# EAGLE design weichen-a-3 (EAGLE 9.6.2)
AUTHOR: Balazs Racz; DRAWING_TITLE: MEB Schalterwerk Projekt; LICENSE: Licensed by the Solderpad Hardware License V2.0; REVIEWER: n/a; REVISION: A; YEAR: 2023
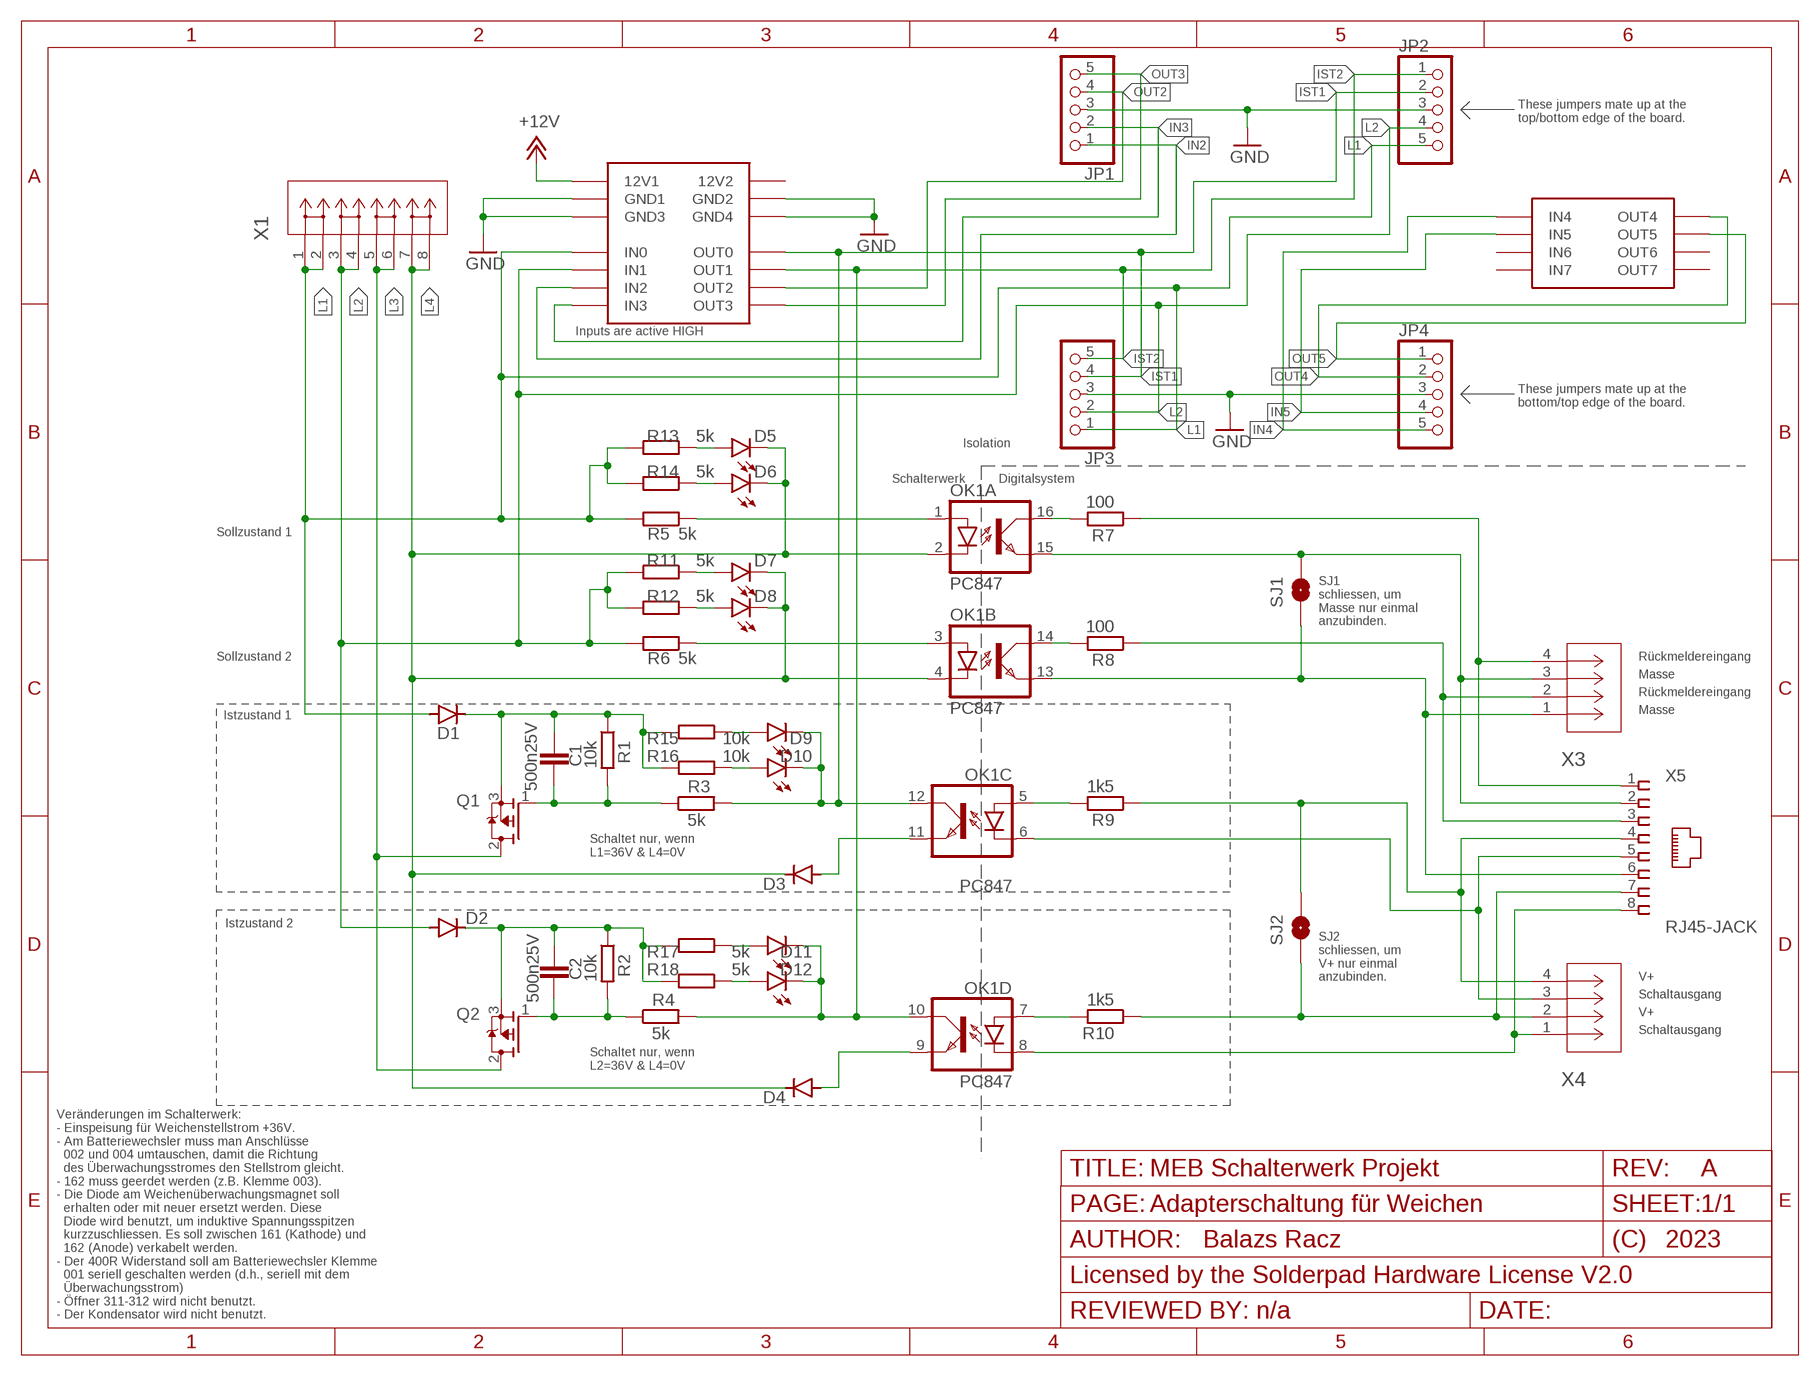
[diagram p0: schematic, sheet 1]
FRAME1 (FRAME_A_L): PAGE: Input ports
FRAME2 (FRAME_A_L): PAGE: Adapterschaltung für Weichen

## Parts
C1  500n25V  C-EUC0805  [C0805]
C2  500n25V  C-EUC0805  [C0805]
D1  DIODE-DO214AC  [DO214AC]
D2  DIODE-DO214AC  [DO214AC]
D3  DIODE-MINIMELF  [MINIMELF]
D4  DIODE-MINIMELF  [MINIMELF]
D5  LEDCHIPLED_0603  [CHIPLED_0603]
D6  LEDHEADER  [LEDHEADER]
D7  LEDCHIPLED_0603  [CHIPLED_0603]
D8  LEDHEADER  [LEDHEADER]
D9  LEDCHIPLED_0603  [CHIPLED_0603]
D10  LEDHEADER  [LEDHEADER]
D11  LEDCHIPLED_0603  [CHIPLED_0603]
D12  LEDHEADER  [LEDHEADER]
JP1  PINHD-1X55X2MM  [1_05X2MM]
JP2  PINHD-1X55X2MM  [1_05X2MM]
JP3  PINHD-1X55X2MM  [1_05X2MM]
JP4  PINHD-1X55X2MM  [1_05X2MM]
OK1  PC847  [DIL16]
Q1  P-MOSFET  [DPAK-2]
Q2  P-MOSFET  [DPAK-2]
R1  10k  R-EU_R0805  [R0805]
R2  10k  R-EU_R0805  [R0805]
R3  5k  R-EU_R0805  [R0805]
R4  5k  R-EU_R0805  [R0805]
R5  5k  R-EU_R0805  [R0805]
R6  5k  R-EU_R0805  [R0805]
R7  100  R-EU_R0805  [R0805]
R8  100  R-EU_R0805  [R0805]
R9  1k5  R-EU_R0805  [R0805]
R10  1k5  R-EU_R0805  [R0805]
R11  5k  R-EU_R0805  [R0805]
R12  5k  R-EU_R0805  [R0805]
R13  5k  R-EU_R0805  [R0805]
R14  5k  R-EU_R0805  [R0805]
R15  10k  R-EU_R0805  [R0805]
R16  10k  R-EU_R0805  [R0805]
R17  5k  R-EU_R0805  [R0805]
R18  5k  R-EU_R0805  [R0805]
SJ1  SJRND2  [SJ_RND2]
SJ2  SJRND2  [SJ_RND2]
X1  PHNX_4P_508CONN_1017493  [PHNX_4P_508]
X2  IO-HAT  [IOBOARD]
X3  PHNX_4P_350CONN_1984989_PXC  [PHNX_4P_350]
X4  PHNX_4P_350CONN_1984989_PXC  [PHNX_4P_350]
X5  RJ45-JACK  RJ45-JACKRJ45-PULSE-E5J00  [RJ45-PULSE-E5J88]

## Nets
+12V: X2.P$1(12V1)
GND: JP1.3 JP2.3 JP3.3 JP4.3 X2.P$2(GND1) X2.P$11(GND3) X2.P$12(GND4) X2.P$21(GND2)
IN2: JP1.1 X2.P$5(IN2)
IN3: JP1.2 X2.P$6(IN3)
IN4: JP4.5 X2.P$7(IN4)
IN5: JP4.4 X2.P$8(IN5)
IST1: D9.C D10.C JP2.2 JP3.4 OK1.12(C:COL) R3.2 X2.P$20(OUT0)
IST2: D11.C D12.C JP2.1 JP3.5 OK1.10(D:COL) R4.2 X2.P$19(OUT1)
L1: D1.A JP2.5 JP3.1 R5.2 R13.2 R14.2 X1.1 X1.2 X2.P$3(IN0)
L2: D2.A JP2.4 JP3.2 R6.2 R11.2 R12.2 X1.3 X1.4 X2.P$4(IN1)
L3: Q1.2(D) Q2.2(D) X1.5 X1.6
L4: D3.C D4.C D5.C D6.C D7.C D8.C OK1.2(A:C) OK1.4(B:C) X1.7 X1.8
N$1: C2.1 D2.C Q2.3(S) R2.1 R17.2 R18.2
N$2: OK1.1(A:A) R5.1
N$3: D7.A R11.1
N$4: D5.A R13.1
N$5: OK1.5(C:A) R9.2
N$6: D6.A R14.1
N$7: OK1.3(B:A) R6.1
N$8: OK1.7(D:A) R10.2
N$10: D8.A R12.1
N$11: D9.A R15.1
N$12: C2.2 Q2.1(G) R2.2 R4.1
N$13: C1.1 D1.C Q1.3(S) R1.1 R15.2 R16.2
N$14: D10.A R16.1
N$17: D3.A OK1.11(C:EMIT)
N$18: D11.A R17.1
N$19: OK1.16(A:COL) R7.2
N$20: D12.A R18.1
N$21: OK1.14(B:COL) R8.2
N$22: D4.A OK1.9(D:EMIT)
N$23: C1.2 Q1.1(G) R1.2 R3.1
NX41: R7.1 X3.4 X5.1
NX42: OK1.15(A:EMIT) SJ1.P$2 X3.3 X5.2
NX43: R8.1 X3.2 X5.3
NX44: R9.1 SJ2.P$2 X4.4 X5.4
NX45: OK1.6(C:C) X4.3 X5.5
NX46: OK1.13(B:EMIT) SJ1.P$1 X3.1 X5.6
NX47: R10.1 SJ2.P$1 X4.2 X5.7
NX48: OK1.8(D:C) X4.1 X5.8
OUT2: JP1.4 X2.P$18(OUT2)
OUT3: JP1.5 X2.P$17(OUT3)
OUT4: JP4.2 X2.P$16(OUT4)
OUT5: JP4.1 X2.P$15(OUT5)
Unconnected: X2.P$9(IN6) X2.P$10(IN7) X2.P$13(OUT7) X2.P$14(OUT6)

## Notes on the sheet
- These jumpers mate up at the 
  top/bottom edge of the board.
- Inputs are active HIGH
- These jumpers mate up at the 
  bottom/top edge of the board.
- Isolation
- Schalterwerk | Digitalsystem
- Sollzustand 1
- SJ1
  schliessen, um
  Masse nur einmal
  anzubinden.
- Sollzustand 2 | Rückmeldereingang
- Masse
- Rückmeldereingang
- Masse
- Istzustand 1
- Schaltet nur, wenn
  L1=36V & L4=0V
- Istzustand 2
- SJ2
  schliessen, um
  V+ nur einmal
  anzubinden.
- V+
- Schaltausgang
- V+
- Schaltausgang
- Schaltet nur, wenn
  L2=36V & L4=0V
- Veränderungen im Schalterwerk:
  - Einspeisung für Weichenstellstrom +36V.
  - Am Batteriewechsler muss man Anschlüsse
    002 und 004 umtauschen, damit die Richtung
    des Überwachungsstromes den Stellstrom gleicht.
  - 162 muss geerdet werden (z.B. Klemme 003).
  - Die Diode am Weichenüberwachungsmagnet soll 
    erhalten oder mit neuer ersetzt werden. Diese
    Diode wird benutzt, um induktive Spannungsspitzen
    kurzzuschliessen. Es soll zwischen 161 (Kathode) und
    162 (Anode) verkabelt werden.
  - Der 400R Widerstand soll am Batteriewechsler Klemme
    001 seriell geschalten werden (d.h., seriell mit dem 
    Überwachungsstrom)
  - Öffner 311-312 wird nicht benutzt.
  - Der Kondensator wird nicht benutzt.

## Power pins joined to a net without a drawn wire
12V2: X2.P$22(12V2)

## Library data of the parts
C1 C2 = rcl:C-EU: CAPACITOR, European symbol; SPICEPREFIX: C
D1-D4 = diode:DIODE-: DIODE
D5 D7 D9 D11 = led:LED: LED OSRAM: - CHIPLED LG R971, LG N971, LY N971, LG Q971, LY Q971, LO R971, LY R971 LH N974, LH R974 LS Q976, LO Q976, LY Q976 LO Q996 - Hyper CHIPLED LW Q18S LB Q993, LB Q99A, LB R99A - SideLED LS A670, LO A670, LY A670, LG A670, LP A670 LB A673, LV A673, LT A673, LW A673 LH A674 LY A675 LS A676, LA A676, LO A676, LY A676, LW A676 LS A679, LY A679, LG A679 - Hyper Micro SIDELED® LS Y876, LA Y876, LO Y876, LY Y876 LT Y87S - SmartLED LW L88C, LW L88S LB L89C, LB L89S, LG L890 LS L89K, LO L89K, LY L89K LS L896, LA L896, LO L896, LY L896 - TOPLED LS T670, LO T670, LY T670, LG T670, LP T670 LSG T670, LSP T670, LSY T670, LOP T670, LYG T670 LG T671, LOG T671, LSG T671 LB T673, LV T673, LT T673, LW T673 LH T674 LS T676, LA T676, LO T676, LY T676, LB T676, LH T676, LSB T676, LW T676 LB T67C, LV T67C, LT T67C, LS T67K, LO T67K, LY T67K, LW E67C LS E67B, LA E67B, LO E67B, LY E67B, LB E67C, LV E67C, LT E67C LW T67C LS T679, LY T679, LG T679 LS T770, LO T770, LY T770, LG T770, LP T770 LB T773, LV T773, LT T773, LW T773 LH T774 LS E675, LA E675, LY E675, LS T675 LS T776, LA T776, LO T776, LY T776, LB T776 LHGB T686 LT T68C, LB T68C - Hyper Mini TOPLED® LB M676 - Mini TOPLED Santana® LG M470 LS M47K, LO M47K, LY M47K Source: http://www.osram.convergy.de LUXEON: - LUMILED® LXK2-PW12-R00, LXK2-PW12-S00, LXK2-PW14-U00, LXK2-PW14-V00 LXK2-PM12-R00, LXK2-PM12-S00, LXK2-PM14-U00 LXK2-PE12-Q00, LXK2-PE12-R00, LXK2-PE12-S00, LXK2-PE14-T00, LXK2-PE14-U00 LXK2-PB12-K00, LXK2-PB12-L00, LXK2-PB12-M00, LXK2-PB14-N00, LXK2-PB14-P00, LXK2-PB14-Q00 LXK2-PR12-L00, LXK2-PR12-M00, LXK2-PR14-Q00, LXK2-PR14-R00 LXK2-PD12-Q00, LXK2-PD12-R00, LXK2-PD12-S00 LXK2-PH12-R00, LXK2-PH12-S00 LXK2-PL12-P00, LXK2-PL12-Q00, LXK2-PL12-R00 Source: www.luxeon.com KINGBRIGHT: KA-3528ASYC Source: www.kingbright.com
D6 D8 D10 D12 = eagleparts:LEDHEADER
JP1-JP4 = pinhead:PINHD-1X5: PIN HEADER
OK1 = optocoupler:PC847: SHARP OPTO COUPLER; OC_FARNELL: 9707735; OC_NEWARK: unknown
Q1 Q2 = eagleparts:P-MOSFET: RoHS Compliant | Low RDS(on) | Industry-leading quality | Dynamic dv/dt Rating | Fast Switching | Fully Avalanche Rated | 175C Operating Temperature | P-Channel MOSFET; MANUFACTURER: Infineon; MAXIMUM_PACKAGE_HEIGHT: 2.39 mm; PARTREV: 12/14/04; STANDARD: IPC-7351B
R1-R18 = rcl:R-EU_: RESISTOR, European symbol; SPICEPREFIX: R
SJ1 SJ2 = eagleparts:SJ: SMD solder JUMPER
X1 = eagleparts:PHNX_4P_508: https://www.digikey.com/en/products/detail/phoenix-contact/1017505/9346606 DigiKey 277-17516-ND; COPYRIGHT: Copyright (C) 2023 Ultra Librarian. All rights reserved.; MANUFACTURER_PART_NUMBER: 1017505; MFR_NAME: Phoenix Contact
X2 = eagleparts:IO-HAT
X3 X4 = eagleparts:PHNX_4P_350: https://www.digikey.com/en/products/detail/phoenix-contact/1984989/2513979 DigiKey 277-6404-ND; COPYRIGHT: Copyright (C) 2023 Ultra Librarian. All rights reserved.; MANUFACTURER_PART_NUMBER: 1984989; MFR_NAME: Phoenix Contact
X5 = trainlib:RJ45-JACK: Mod. Jack, Right Angle, 8 posiotion, 8 contatcs RJ45 Source: GLX-S-88M.pdf

## Board
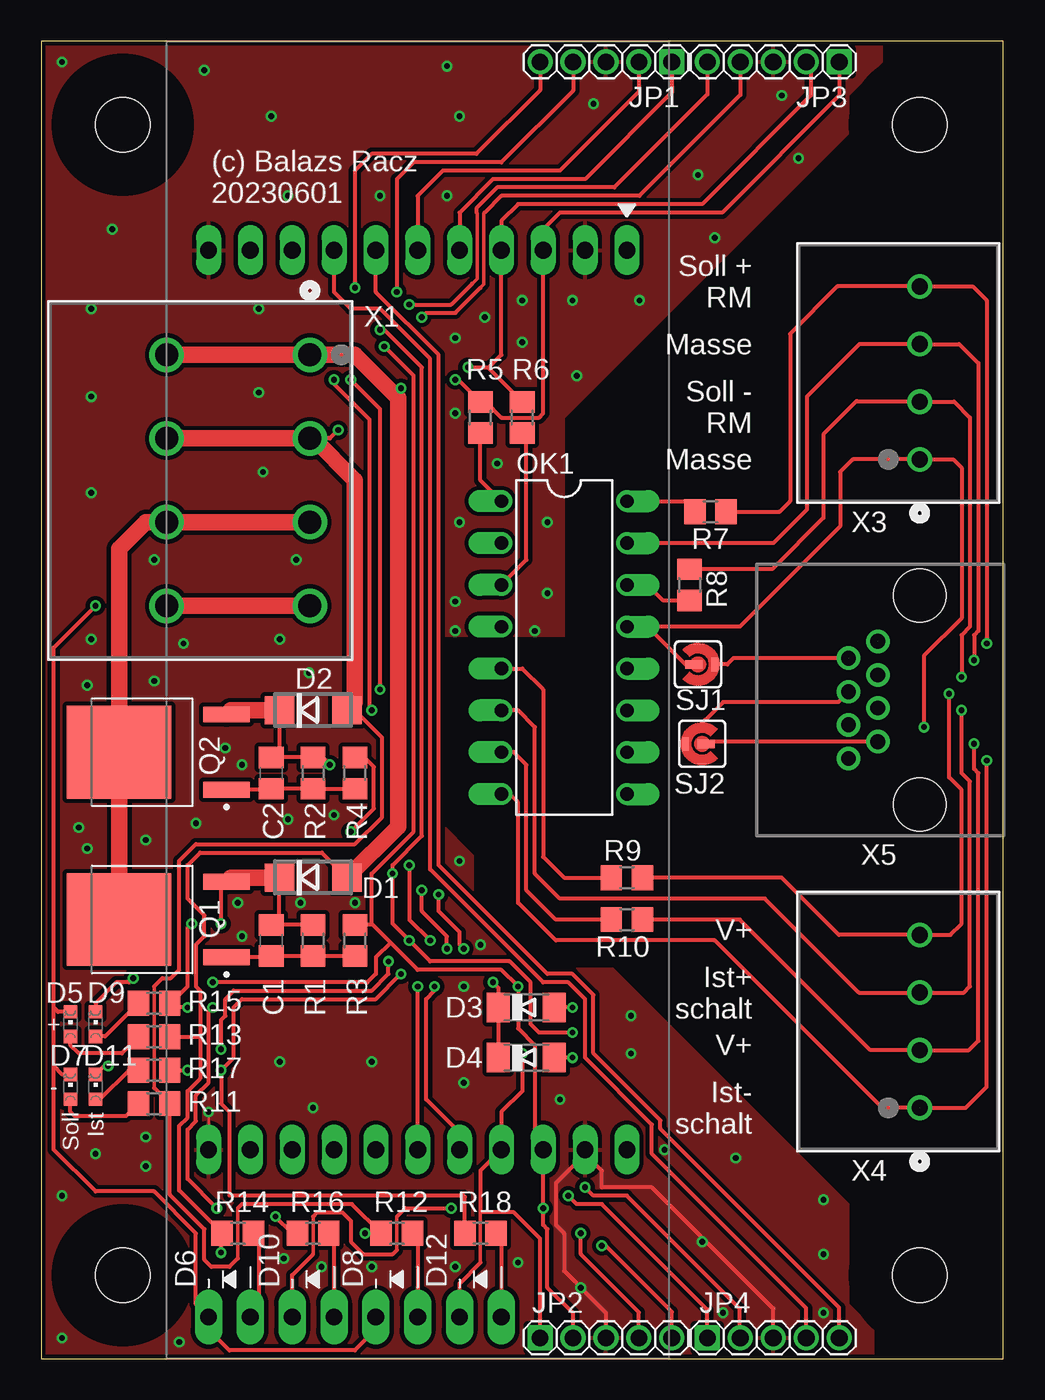
[diagram p1: board, top side]
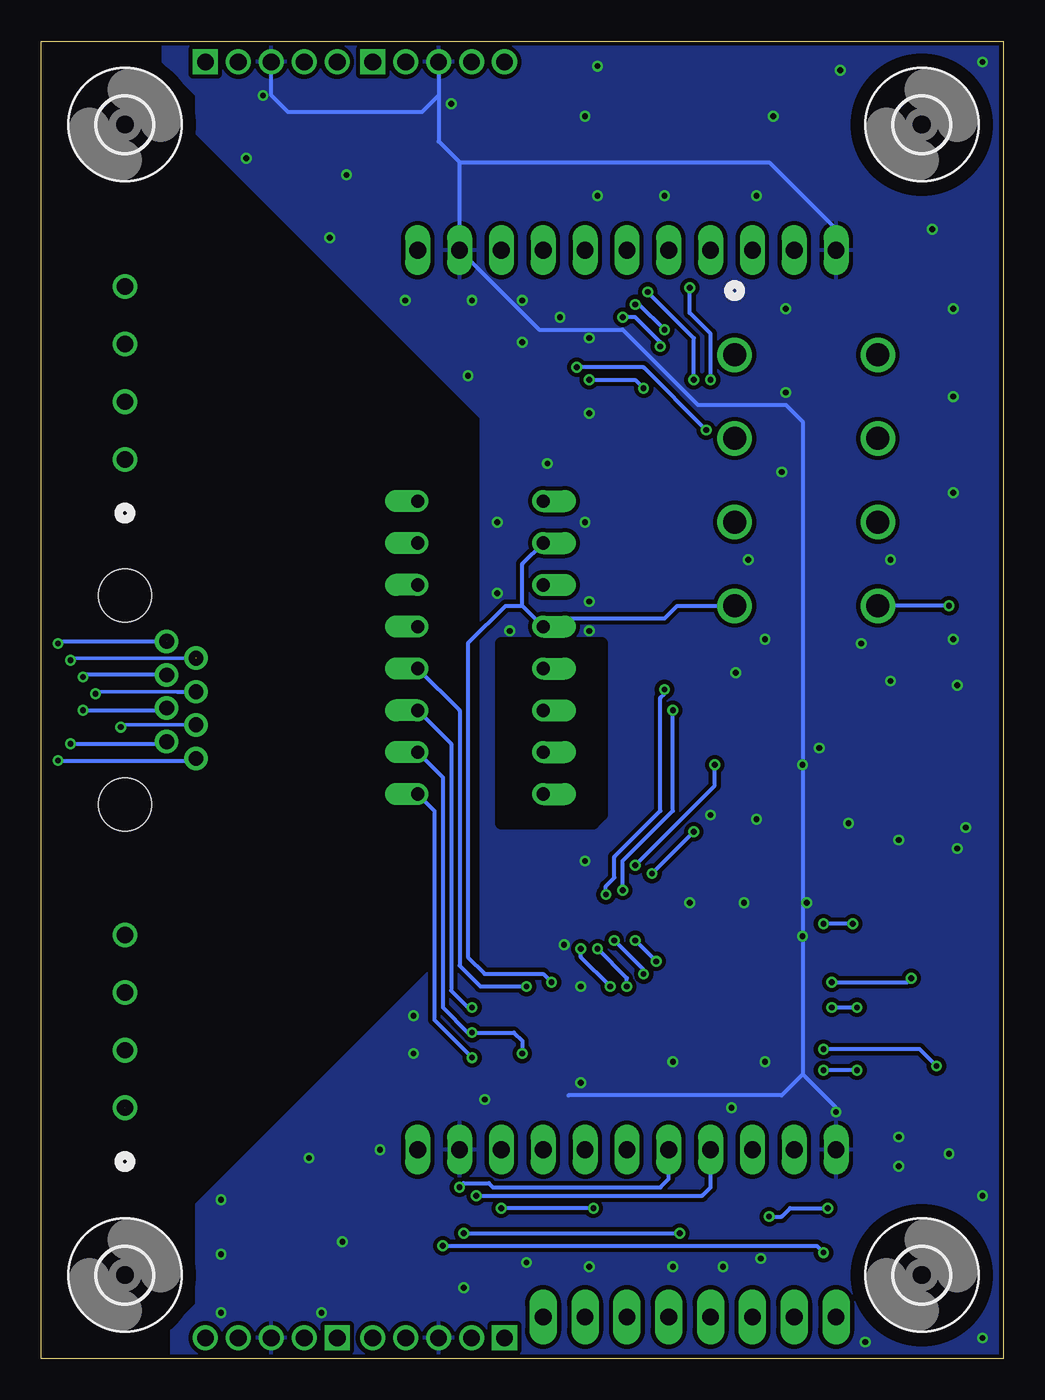
[diagram p2: board, bottom side, seen from below]

Size 58.42 x 80 mm. Coordinates in mm from the lower left corner, seen from the top.
Outline: 0,0 58.42,0 58.42,80 0,80 0,0
Copper layers (1*16): Top 0.035mm / dielectric 1.5mm / Bottom 0.035mm
Design rules "SeeedStudio_2layer_DRU_no_angle_20140221": minimum track width 6mil, minimum drill 12mil, track to track 6mil, track to pad 6mil, pad to pad 6mil, via to via 6mil, smd to smd 0mil, copper to edge 10mil, drill to drill 10mil, minimum pad ring 10mil, minimum via ring 6mil, stop-mask expansion 2mil, vias tented up to drill 100mil, thermal gap 10mil
tRestrict: area 24.4,24.1 to 39.4,43.4
bRestrict: area 24.4,32.5 to 30.5,43.4

### Footprints (pad centres in the part's own frame; a part is rotated, then mirrored left to right if it is on the bottom)
C0805 = smd 1.3 x 1.5: 1 -0.95,0; 2 0.95,0
DO214AC = smd 1.8 x 1.7: A 2.05,0; C -2.05,0
MINIMELF = smd 1.4 x 1.8: A 1.7,0; C -1.7,0
CHIPLED_0603 = smd 0.8 x 0.8: A 0,-0.75; C 0,0.75
LEDHEADER = drill 1.016 pad 1.676 long: A -1.27,0; C 1.27,0
3,3 = hole 3.3: 0,0
1_05X2MM = drill 1.016 pad 1.3 square: 1 -4,0 | drill 1.016 pad 1.3: 2 -2,0; 3 0,0; 4 2,0; 5 4,0
DIL16 = drill 0.813 offset: 1 -8.89,-3.81; 2 -6.35,-3.81; 3 -3.81,-3.81; 4 -1.27,-3.81; 5 1.27,-3.81; 6 3.81,-3.81; 7 6.35,-3.81; 8 8.89,-3.81; 9 8.89,3.81; 10 6.35,3.81; 11 3.81,3.81; 12 1.27,3.81; 13 -1.27,3.81; 14 -3.81,3.81; 15 -6.35,3.81; 16 -8.89,3.81
DPAK-2 = smd 2.83 x 0.97: 1 -4.14,2.29; 3 -4.14,-2.29 | smd 6.35 x 5.63: 2 2.38,0
R0805 = smd 1.3 x 1.5: 1 -0.95,0; 2 0.95,0
SJ_RND2 = smd 1.016 x 0.508: P$1 -0.254,0 | smd 0.406 x 0.813: P$2 1.016,0
PHNX_4P_508 = drill 1.397 pad 1.905: 1 -15.24,8.7; 2 -15.24,0; 3 -10.16,8.7; 4 -10.16,0; 5 -5.08,8.7; 6 -5.08,0; 7 0,8.7; 8 0,0
IOBOARD = drill 1.016 pad 1.524 long: P$1 12.7,27.94; P$2 12.7,25.4; P$3 12.7,22.86; P$4 12.7,20.32; P$5 12.7,17.78; P$6 12.7,15.24; P$7 12.7,12.7; P$8 12.7,10.16; P$9 12.7,7.62; P$10 12.7,5.08; P$11 12.7,2.54; P$12 67.31,2.54; P$13 67.31,5.08; P$14 67.31,7.62; P$15 67.31,10.16; P$16 67.31,12.7; P$17 67.31,15.24; P$18 67.31,17.78; P$19 67.31,20.32; P$20 67.31,22.86; P$21 67.31,25.4; P$22 67.31,27.94
PHNX_4P_350 = drill 0.991 pad 1.499: 1 0,0; 2 3.5,0; 3 7,0; 4 10.5,0
RJ45-PULSE-E5J88 = drill 0.9 pad 1.422: 1 3.555,2.54; 2 2.535,4.32; 3 1.515,2.54; 4 0.495,4.32; 5 -0.495,2.54; 6 -1.515,4.32; 7 -2.535,2.54; 8 -3.555,4.32 | hole 3.2: 6.35,0; -6.35,0

### Placement (x,y rotation side)
C1  13.97,25.4 270 top
C2  13.97,35.56 270 top
D1  16.51,29.21 0 top
D2  16.51,39.37 0 top
D3  29.46,21.34 0 top
D4  29.46,18.29 0 top
D5  1.78,20.32 0 top
D6  11.43,2.54 180 top
D7  1.78,16.51 0 top
D8  21.59,2.54 180 top
D9  3.3,20.32 0 top
D10  16.51,2.54 180 top
D11  3.3,16.51 0 top
D12  26.67,2.54 180 top
H1  MOUNT-HOLE3.3  [3,3]  4.95,74.93 0 bottom
H2  MOUNT-HOLE3.3  [3,3]  4.95,5.08 0 bottom
H3  MOUNT-HOLE3.3  [3,3]  53.34,5.08 0 bottom
H4  MOUNT-HOLE3.3  [3,3]  53.34,74.93 0 bottom
JP1  34.29,78.74 180 top
JP2  34.29,1.27 0 top
JP3  44.45,78.74 180 top
JP4  44.45,1.27 0 top
OK1  31.75,43.18 270 top
Q1  7.11,26.67 180 top
Q2  7.11,36.83 180 top
R1  16.51,25.4 270 top
R2  16.51,35.56 270 top
R3  19.05,25.4 90 top
R4  19.05,35.56 90 top
R5  26.67,57.15 90 top
R6  29.21,57.15 90 top
R7  40.64,51.44 180 top
R8  39.37,46.99 270 top
R9  35.56,29.21 180 top
R10  35.56,26.67 180 top
R11  6.86,15.49 0 top
R12  21.59,7.62 180 top
R13  6.86,19.56 0 top
R14  11.94,7.62 180 top
R15  6.86,21.59 0 top
R16  16.51,7.62 180 top
R17  6.86,17.53 0 top
R18  26.67,7.62 180 top
SJ1  39.88,42.16 0 top
SJ2  40.13,37.34 180 top
X1  7.62,45.72 270 top
X2  7.62,80.01 270 top
X3  53.34,54.61 90 top
X4  53.34,15.24 90 top
X5  53.34,40.01 90 top

### Tracks (layer width: path | path; a pad name or v marks a point on that pad's centre or on a via)
GND  (via drill 0.35)
  Top 0.152: X2.P$12 v10.16,14.99
  Top 0.254: X2.P$21 33.02,12.45 | 33.02,12.45 31.24,10.67 31.24,8.13 31.75,7.62 31.75,5.33 34.29,2.79 JP2.3 | JP4.3 44.45,3.05 37.08,10.41 34.04,10.41 34.04,11.43 33.02,12.45
  Bottom 0.254: JP1.3 34.29,76.71 | 34.29,76.71 35.31,75.69 43.43,75.69 44.45,76.71 JP3.3 | 34.29,76.71 34.29,73.91 33.02,72.64 | 33.02,72.64 X2.P$2 28.19,62.48 23.11,62.48 18.54,57.91 13.21,57.91 12.19,56.9 12.19,17.27 | 33.02,72.64 14.22,72.64 10.16,68.58 X2.P$11 | v10.16,14.99 10.16,15.24 12.19,17.27 | 12.19,17.27 13.46,16 26.42,16
  other vias: 14.48,18.03 20.07,18.03 25.65,16.76 25.65,22.61 35.81,20.83 35.81,18.54 47.5,6.35 47.5,9.65 42.16,12.19 16.51,15.24 6.35,13.46 6.35,11.68 3.3,12.45 1.27,9.91 1.27,1.27 8.38,1.02 20.07,5.59 25.15,5.59 28.96,5.84 17.02,5.59 14.73,6.1 32.77,4.32 40.13,7.11 41.4,2.79 47.5,2.79 37.85,12.7 31.5,15.75 26.67,25.15 25.4,30.23 15.75,27.69 19.05,27.69 11.94,27.69 12.19,25.65 11.18,37.08 12.19,36.07 9.4,32.51 14.99,32.77 17.78,33.02 6.35,31.5 2.29,32.26 2.79,30.99 2.79,40.89 3.05,43.69 6.86,41.15 16.26,41.66 14.48,43.69 8.64,43.43 6.86,48.51 15.49,48.51 13.46,53.85 13.21,58.67 3.05,58.42 3.05,52.58 3.05,63.75 13.21,63.75 4.32,68.58 14.99,70.61 13.97,75.44 25.4,75.44 24.64,78.49 9.91,78.23 1.27,78.74 33.53,76.2 39.88,71.88 44.96,76.71 45.97,72.9 40.89,68.07 32.26,64.26 36.32,64.26 32.51,59.69 30.73,50.8 30.73,46.48 29.97,44.2 25.4,50.8 25.15,57.4 25.15,45.97 25.15,44.2 27.69,54.36 29.21,64.26 29.21,61.72 26.92,63.25 25.15,61.98 24.64,70.61 20.57,70.61
  pour Top (isolate 0.254): 0.25,79.76 51.05,79.76 51.05,78.74 49.02,76.71 49.02,74.42 31.75,57.15 31.75,23.88 34.54,23.88 49.02,9.4 49.02,3.3 50.55,1.78 50.55,0.25 0.25,0.25
  pour Bottom (isolate 0.254): 0.25,79.76 51.05,79.76 51.05,78.74 49.02,76.71 49.02,74.42 31.75,57.15 31.75,23.88 34.54,23.88 49.02,9.4 49.02,3.3 50.55,1.78 50.55,0.25 0.25,0.25
IN2
  Top 0.254: JP1.1 38.29,76.9 33.02,71.63 27.43,71.63 25.4,69.6 X2.P$5
IN3
  Top 0.254: JP1.2 36.29,76.93 31.5,72.14 24.38,72.14 22.86,70.61 X2.P$6
IN4
  Top 0.254: JP4.5 48.45,3.11 37.59,13.97 37.59,14.48 33.53,18.54 33.53,22.1 32.26,23.37 30.73,23.37 24.13,29.97 24.13,60.96 20.32,64.77 X2.P$7
IN5
  Top 0.254: JP4.4 46.45,3.08 37.08,12.45 37.08,14.22 33.02,18.29 33.02,21.84 32,22.86 30.48,22.86 23.62,29.72 23.62,60.71 20.57,63.75 18.8,63.75 17.78,64.77 X2.P$8
IST1  (via drill 0.35)  (1 unrouted)
  Top 0.203: 16.51,6.35 16.51,8.64 | 21.59,6.6 21.59,8.64 | 26.92,69.6 26.87,69.55 26.87,65.23 26.67,65.02
  Top 0.254: 20.13,26.35 R3.2 | 21.21,25.27 22.86,23.62 27.94,23.62 v28.96,22.61 28.96,20.07 29.97,19.05 29.97,13.21 X2.P$20 v30.48,9.14 30.48,8.13 30.73,7.87 30.73,4.32 32.29,2.76 JP2.2 | 21.21,25.27 20.13,26.35 | D10.C 15.24,5.08 16.51,6.35 | 16.51,8.64 16.76,8.89 18.29,8.89 18.8,8.38 18.8,7.11 19.56,6.35 21.34,6.35 21.59,6.6 | 21.59,8.64 22.1,9.14 v24.89,9.14 | 21.21,25.27 20.32,24.38 20.32,23.37 19.81,22.86 v10.41,22.86 | v5.59,23.11 5.33,22.86 4.57,22.86 3.3,21.59 D9.C | 20.13,26.35 20.07,26.42 20.07,29.46 22.61,32 22.61,59.69 v20.83,61.47 | JP3.4 42.45,76.74 36.32,70.61 27.94,70.61 26.92,69.6 | v23.11,63.25 23.37,63.5 25.15,63.5 26.67,65.02
  Bottom 0.254: OK1.12 33.02,39.37 33.02,23.88 31.75,22.61 v28.96,22.61 | v10.41,22.86 5.84,22.86 v5.59,23.11 | v24.89,9.14 v30.48,9.14 | v20.83,61.47 20.83,61.72 22.35,63.25 v23.11,63.25
IST2  (via drill 0.35)
  Top 0.203: 26.67,5.84 26.67,8.89 | 26.42,69.6 26.47,69.55 26.47,65.58 26.16,65.28
  Top 0.254: v32.26,19.81 30.23,19.81 29.72,20.32 29.72,22.86 28.45,24.13 23.62,24.13 v22.35,25.4 21.34,26.42 v21.34,29.46 21.34,29.97 23.11,31.75 23.11,60.2 20.83,62.48 v20.57,62.48 | v29.21,18.54 29.21,16.26 27.94,14.99 X2.P$19 26.67,11.43 26.67,8.89 28.7,8.89 30.29,7.3 JP2.1 | v18.8,32 20.19,33.4 20.19,35.94 19.56,36.58 19.12,36.58 R4.2 | D12.C 25.4,4.57 26.67,5.84 | D11.C 3.82,17.78 v4.06,17.78 | v10.92,18.8 10.92,20.57 11.18,20.83 11.18,21.84 11.68,22.35 20.07,22.35 21.08,23.37 v21.08,24.13 | JP3.5 40.45,76.77 34.8,71.12 27.69,71.12 26.42,69.85 26.42,69.6 | 26.16,65.28 24.89,64.01 v22.35,64.01
  Bottom 0.254: OK1.10 34.04,35.31 34.04,21.34 32.51,19.81 v32.26,19.81 29.72,19.81 29.21,19.3 v29.21,18.54 | v21.34,29.46 v18.8,32 | v4.06,17.78 5.08,18.8 v10.92,18.8 | v21.08,24.13 v22.35,25.4 | v20.57,62.48 22.1,64.01 v22.35,64.01
L1  (via drill 0.35)
  Top 0.254: 21.91,58.1 21.67,58.34 21.59,58.42 21.59,58.67 v21.84,58.93 | D1.A 17.04,30.73 9.65,30.73 8.89,29.97 8.89,27.94 9.91,26.92 9.91,25.65 9.4,25.15 9.4,22.61 9.65,22.35 9.65,19.56 | 8.89,14.65 8.38,14.14 8.38,10.23 R14.2 10.92,7.55 v10.92,6.45 | 8.89,14.65 | 8.89,14.65 8.89,16.26 9.65,17.02 9.65,19.56 | 8.13,19.3 8.13,19.24 R13.2 9.65,19.56 | JP2.5 38.29,2.86 34.29,6.86 v34.04,6.86 | JP3.1 48.45,76.71 41.34,69.6 31.5,69.6 30.48,68.58 X2.P$3 30.48,57.4 30.23,57.15 27.94,57.15 26.99,58.1 R5.2 25.33,59.44 v25.15,59.44
  Top 1.016: D1.A 21.67,32.32 21.67,58.34 | 21.59,58.42 19.05,60.96 X1.1 X1.2
  Bottom 0.254: v34.04,6.86 11.33,6.86 v10.92,6.45 | v25.15,59.44 22.35,59.44 v21.84,58.93
L2  (via drill 0.35)
  Top 0.203: 11.94,9.14 11.94,6.1 | 6.86,22.61 6.86,16.44
  Top 0.254: R6.2 27.15,60.16 | v18.03,56.39 17.53,55.88 X1.3 | 27.15,60.16 27.94,60.96 X2.P$4 27.94,69.09 28.96,70.1 40.13,70.1 46.74,76.71 46.74,78.45 JP3.2 | 6.86,22.61 7.37,23.11 7.87,23.11 8.38,23.62 8.38,30.23 9.4,31.24 19.05,31.24 20.7,32.89 20.7,37.72 19.05,39.37 D2.A | 11.94,9.14 12.19,9.4 18.86,9.4 R12.2 v19.66,7.62 | 11.94,6.1 11.43,5.59 10.34,5.59 9.91,6.02 9.91,7.87 7.81,9.97 R11.2 6.86,16.44 | JP2.4 36.29,2.83 32.77,6.35 v32.77,7.62 | v25.91,60.2 27.11,60.2 27.15,60.16
  Top 1.016: D2.A 19.05,39.86 19.05,53.34 16.51,55.88 X1.3 X1.4
  Bottom 0.254: v18.03,56.39 21.84,60.2 v25.91,60.2 | v32.77,7.62 v19.66,7.62
L3
  Top 1.016: Q1.2 Q2.2 4.73,49.18 6.35,50.8 X1.6 X1.5
L4  (via drill 0.35)
  Top 0.254: v27.43,22.86 27.76,22.53 D3.C D4.C | D7.C 1.28,17.26 0.76,17.78 | 0.76,17.78 0.76,21.34 | D5.C 1.03,21.07 0.76,21.34 | v3.3,45.72 0.76,43.18 0.76,21.34 | D8.C 20.32,1.78 19.05,0.51 11.43,0.51 10.16,1.78 D6.C 9.4,3.3 9.4,7.62 6.86,10.16 3.3,10.16 0.76,12.7 0.76,17.78
  Top 1.016: X1.7 X1.8
  Bottom 0.254: 29.21,45.72 OK1.4 27.43,44.96 20.57,44.96 19.81,45.72 X1.7 | OK1.2 29.21,48.26 29.21,45.72 | 29.21,45.72 30.23,45.72 32.51,43.43 32.51,24.38 31.5,23.37 27.94,23.37 v27.43,22.86 | v3.3,45.72 X1.8
N$1  (via drill 0.35)
  Top 0.254: D2.C 14.48,39.35 14.48,37.02 C2.1 R2.1 17.08,36.51 v17.53,36.07 | R17.2 v8.89,17.53 | R18.2 25.72,9.84 25.65,9.91 11.43,9.91 11.43,14.99 10.92,15.49 v10.92,17.53 11.68,18.29 11.68,21.34 12.19,21.84 20.32,21.84 v21.84,23.37 | v23.62,25.4 22.35,26.67 v22.35,29.97
  Top 1.016: Q2.3 11.5,39.37 D2.C
  Bottom 0.254: v8.89,17.53 v10.92,17.53 | v21.84,23.37 21.84,23.62 v23.62,25.4 | v22.35,29.97 17.53,34.8 v17.53,36.07
N$2
  Top 0.254: OK1.1 26.67,53.34 R5.1
N$3
  Top 0.254: R11.1 5.15,14.73 2.03,14.73 1.78,14.99 D7.A
N$4
  Top 0.254: D5.A 1.78,19.05 2.29,18.54 4.89,18.54 R13.1
N$5
  Top 0.254: OK1.5 29.21,41.91 30.48,40.64 30.48,30.48 31.75,29.21 R9.2
N$6
  Top 0.254: D6.A 13.21,3.05 13.21,7.62 R14.1
N$7
  Top 0.254: OK1.3 29.46,48.51 29.46,55.95 R6.1
N$8
  Top 0.254: R10.2 31.24,26.67 29.46,28.45 29.46,36.07 28.7,36.83 OK1.7
N$10
  Top 0.254: R12.1 22.86,7.3 D8.A
N$11
  Top 0.254: R15.1 3.89,19.57 D9.A
N$12
  Top 0.254: 16.44,34.54 R2.2 | R2.2 R4.1 | R2.2 C2.2 13.9,34.54 Q2.1
N$13  (via drill 0.35)
  Top 0.254: R1.1 C1.1 14.46,26.84 D1.C | R15.2 7.87,21.59 | 7.87,21.59 8.89,22.61 8.89,26.16 v9.14,26.42 | v10.92,26.42 10.92,28.63 Q1.3 | R16.2 15.24,7.62 v14.22,8.64 | v10.67,9.14 8.89,10.92 8.89,13.92 9.4,14.43 9.4,16 10.16,16.76 10.16,21.08 v10.41,21.34 | v8.89,21.34 8.13,21.34 7.87,21.59
  Top 1.016: Q1.3 11.5,29.21 D1.C
  Bottom 0.254: v9.14,26.42 v10.92,26.42 | v14.22,8.64 13.46,8.64 12.95,9.14 v10.67,9.14 | v10.41,21.34 v8.89,21.34
N$14
  Top 0.254: D10.A 17.78,7.3 R16.1
N$17  (via drill 0.35)
  Top 0.254: v32.26,21.34 D3.A
  Bottom 0.254: OK1.11 33.53,37.34 33.53,22.35 32.51,21.34 v32.26,21.34
N$18
  Top 0.254: R17.1 5.33,17.53 3.57,15.76 D11.A
N$19
  Top 0.254: OK1.16 39.05,52.07 R7.2
N$20
  Top 0.254: R18.1 27.94,7.3 D12.A
N$21
  Top 0.254: R8.2 37.78,46.04 36.83,46.99 OK1.14
N$22  (via drill 0.35)
  Top 0.254: v32.26,18.29 D4.A
  Bottom 0.254: OK1.9 34.54,33.27 34.54,20.57 v32.26,18.29
N$23
  Top 0.254: 11.32,24.45 Q1.1 13.9,24.38 C1.2 R1.2 R3.1
NX41  (via drill 0.35)  (2 unrouted)
  Top 0.254: v57.4,43.43 57.4,64.26 56.56,65.11 X3.4 48.35,65.11 45.47,62.23 45.47,52.07 44.83,51.44 R7.1
  Bottom 0.254: v57.4,43.43 57.28,43.56 X5.1
NX42  (via drill 0.35)  (1 unrouted)
  Top 0.254: v56.64,42.42 56.64,43.94 56.9,44.2 56.9,60.45 55.74,61.61 X3.3 49.67,61.61 46.48,58.42 46.48,51.56 44.45,49.53 OK1.15 | X5.2 42.03,42.54 41.66,42.16 SJ1.P$2
  Bottom 0.203: X5.2 56.52,42.54
  Bottom 0.254: 56.52,42.54 v56.64,42.42
NX43  (via drill 0.35)
  Top 0.254: v55.88,41.4 55.88,43.94 56.39,44.45 56.39,57.15 55.43,58.11 X3.2 49.59,58.11 49.53,58.17 47.5,56.13 47.5,51.05 44.38,47.94 R8.1
  Bottom 0.254: X5.3 55.76,41.52 v55.88,41.4
NX44  (via drill 0.35)
  Top 0.254: X4.4 55.2,25.74 55.88,26.42 55.88,34.54 55.12,35.31 v55.12,40.39 | X4.4 52.75,25.74 | X4.4 48.43,25.74 44.96,29.21 R9.1 | X5.4 48.4,39.88 41.4,39.88 39.37,37.85 39.37,37.59 SJ2.P$2
  Bottom 0.203: 55,40.5 50.14,40.5
  Bottom 0.254: 55,40.5 v55.12,40.39 | 50.14,40.5 X5.4
NX45  (via drill 0.35)
  Top 0.254: v55.88,39.37 55.88,35.56 56.39,35.05 56.39,22.61 56.02,22.24 X4.3 49.64,22.24 43.94,27.94 31.5,27.94 29.97,29.46 29.97,38.35 28.96,39.37 OK1.6
  Bottom 0.254: v55.88,39.37 50.94,39.37 X5.5
NX46  (via drill 0.35)
  Top 0.254: v53.59,38.35 53.59,42.67 55.88,44.96 55.88,54.1 55.37,54.61 X3.1 49.28,54.61 48.51,53.85 48.51,50.55 42.42,44.45 OK1.13 36.83,44.45 39.12,42.16 SJ1.P$1
  Bottom 0.203: X5.6 53.46,38.49
  Bottom 0.254: 53.46,38.49 v53.59,38.35
NX47  (via drill 0.35)
  Top 0.254: v56.64,37.34 56.64,35.81 56.9,35.56 56.9,19.3 56.33,18.74 X4.2 50.35,18.74 42.42,26.67 R10.1 | SJ2.P$1 40.52,37.47 X5.7
  Bottom 0.254: v56.64,37.34 50.93,37.34 X5.7
NX48  (via drill 0.35)  (2 unrouted)
  Top 0.254: v57.4,36.32 57.4,16.51 56.13,15.24 X4.1 51.05,15.24 40.89,25.4 31.24,25.4 28.96,27.69 28.96,33.78 28.45,34.29 OK1.8
  Bottom 0.254: v57.4,36.32 49.15,36.32 X5.8
OUT2  (via drill 0.35)
  Top 0.254: X2.P$18 25.4,13.72 23.37,15.75 23.37,21.84 23.88,22.35 v23.88,22.61 | v25.65,24.89 25.4,25.15 25.4,25.91 24.13,27.18 v24.13,28.19 | v18.8,59.44 20.57,57.66 v20.57,40.64 | JP1.4 32.29,76.99 27.94,72.64 22.61,72.64 21.59,71.63 v21.59,64.77
  Bottom 0.254: v23.88,22.61 25.65,24.38 v25.65,24.89 | v24.13,28.19 24.13,28.7 23.62,29.21 23.62,30.48 20.83,33.27 20.83,40.13 20.57,40.39 v20.57,40.64 | v18.8,59.44 18.8,61.98 v21.59,64.77
OUT3  (via drill 0.35)
  Top 0.254: X2.P$17 v22.86,22.61 | v24.64,24.89 24.64,25.65 23.11,27.18 v23.11,28.45 | v20.07,39.37 19.94,39.5 19.94,57.02 17.78,59.18 v17.78,59.44 | JP1.5 30.29,77.03 26.42,73.15 20.07,73.15 19.05,72.14 v19.05,65.02
  Bottom 0.254: v22.86,22.61 22.86,23.11 v24.64,24.89 | v23.11,28.45 23.11,30.23 20.07,33.27 v20.07,39.37 | v17.78,59.44 17.78,62.23 19.05,63.5 v19.05,65.02
OUT4  (via drill 0.35)
  Top 0.254: JP4.2 42.42,1.3 42.42,3.05 35.56,9.91 33.53,9.91 v33.02,10.41
  Bottom 0.254: v33.02,10.41 32.77,10.67 31.24,10.67 30.99,10.41 20.83,10.41 20.32,10.92 X2.P$16
OUT5  (via drill 0.35)
  Top 0.254: JP4.1 40.45,2.98 34.04,9.4 32.51,9.4 v32,9.91
  Bottom 0.254: v32,9.91 18.29,9.91 17.78,10.41 X2.P$15

### Text on the board
tNames: (c) Balazs Racz / 20230601 | Soll + / RM | Masse | Soll - / RM | Masse | V+ | Ist+ / schalt | + | V+ | - | Soll | Ist | Ist- / schalt